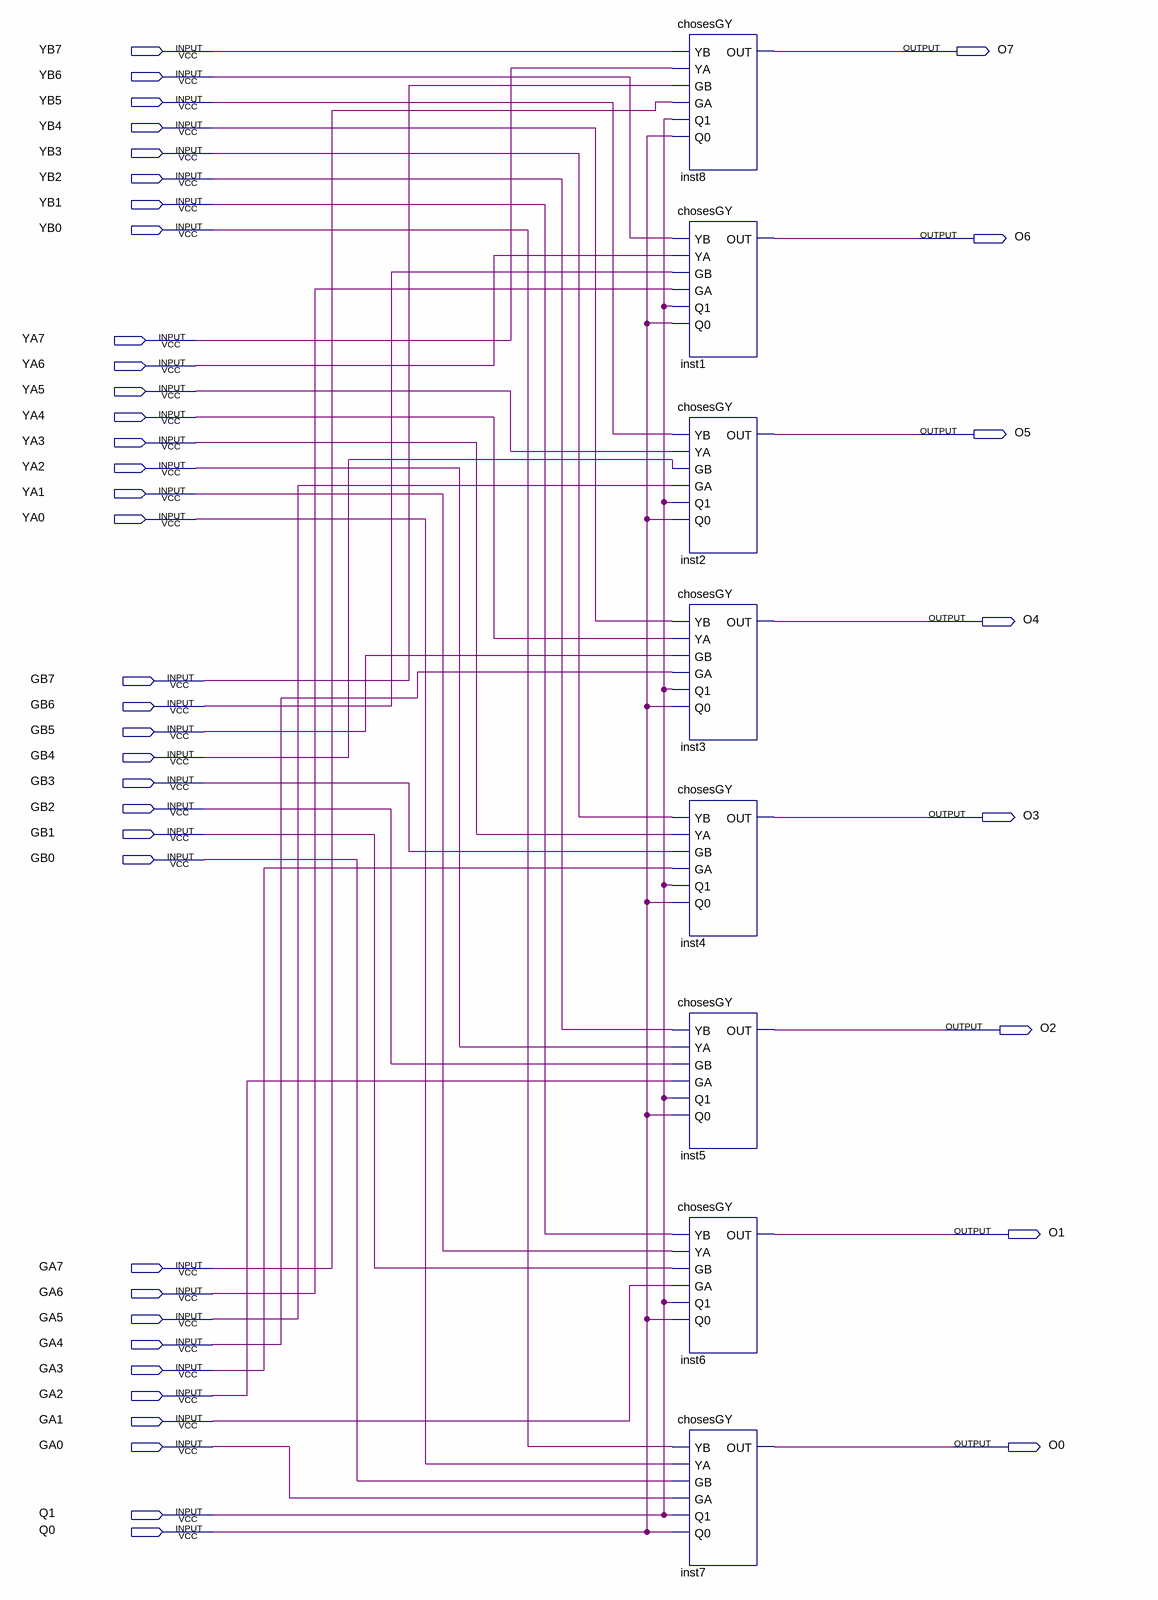
[diagram p0: schematic sheet]
// Quartus schematic choseGY.bdf as structural Verilog: 8 symbols, 42 pins
module choseGY (
  input  YB7,
  input  YB6,
  input  YB5,
  input  YB4,
  input  YB3,
  input  YB2,
  input  YB1,
  input  YB0,
  input  YA7,
  input  YA6,
  input  YA5,
  input  YA4,
  input  YA3,
  input  YA2,
  input  YA1,
  input  YA0,
  input  GB7,
  input  GB6,
  input  GB5,
  input  GB4,
  input  GB3,
  input  GB2,
  input  GB1,
  input  GB0,
  input  GA7,
  input  GA6,
  input  GA5,
  input  GA4,
  input  GA3,
  input  GA2,
  input  GA1,
  input  GA0,
  input  Q1,
  input  Q0,
  output O7,
  output O6,
  output O5,
  output O4,
  output O3,
  output O2,
  output O1,
  output O0
);

  chosesGY inst8 (.YB(YB7), .YA(YA7), .GB(GB7), .GA(GA7), .Q1(Q1), .Q0(Q0), .OUT(O7));
  chosesGY inst1 (.YB(YB6), .YA(YA6), .GB(GB6), .GA(GA6), .Q1(Q1), .Q0(Q0), .OUT(O6));
  chosesGY inst2 (.YB(YB5), .YA(YA5), .GB(GB4), .GA(GA5), .Q1(Q1), .Q0(Q0), .OUT(O5));
  chosesGY inst3 (.YB(YB4), .YA(YA4), .GB(GB5), .GA(GA4), .Q1(Q1), .Q0(Q0), .OUT(O4));
  chosesGY inst4 (.YB(YB3), .YA(YA3), .GB(GB3), .GA(GA3), .Q1(Q1), .Q0(Q0), .OUT(O3));
  chosesGY inst5 (.YB(YB2), .YA(YA2), .GB(GB2), .GA(GA2), .Q1(Q1), .Q0(Q0), .OUT(O2));
  chosesGY inst6 (.YB(YB1), .YA(YA1), .GB(GB1), .GA(GA1), .Q1(Q1), .Q0(Q0), .OUT(O1));
  chosesGY inst7 (.YB(YB0), .YA(YA0), .GB(GB0), .GA(GA0), .Q1(Q1), .Q0(Q0), .OUT(O0));
endmodule
